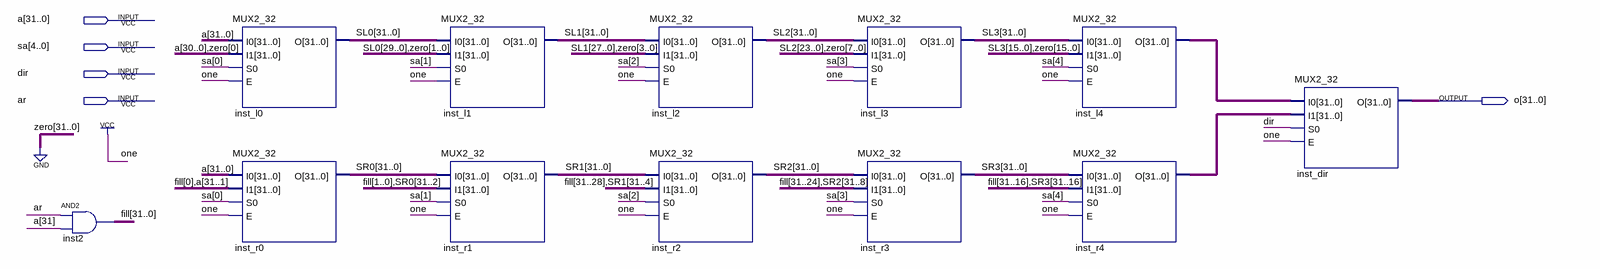
[diagram p0: schematic sheet]
// Quartus schematic SHIFT32.bdf as structural Verilog: 12 symbols, 5 pins
module SHIFT32 (
  input  [31:0] a,
  input  [4:0] sa,
  input  dir,
  input  ar,
  output [31:0] o
);

  wire [31:0] fill, inst_l4_o, inst_r4_o, SL0, SL1, SL2, SL3, SR0, SR1, SR2, SR3;

  assign fill = {32{ar}} & {32{a[31]}};  // AND2 inst2, 32 bits wide
  MUX2_32 inst_l0 (.I0(a), .I1({a[30:0], 1'b0}), .S0(sa[0]), .E(1'b1), .O(SL0));
  MUX2_32 inst_r0 (.I0(a), .I1({fill[0], a[31:1]}), .S0(sa[0]), .E(1'b1), .O(SR0));
  MUX2_32 inst_l1 (.I0(SL0), .I1({SL0[29:0], 2'b00}), .S0(sa[1]), .E(1'b1), .O(SL1));
  MUX2_32 inst_r1 (.I0(SR0), .I1({fill[1:0], SR0[31:2]}), .S0(sa[1]), .E(1'b1), .O(SR1));
  MUX2_32 inst_l2 (.I0(SL1), .I1({SL1[27:0], 4'b0000}), .S0(sa[2]), .E(1'b1), .O(SL2));
  MUX2_32 inst_r2 (.I0(SR1), .I1({fill[31:28], SR1[31:4]}), .S0(sa[2]), .E(1'b1), .O(SR2));
  MUX2_32 inst_l3 (.I0(SL2), .I1({SL2[23:0], {8{1'b0}}}), .S0(sa[3]), .E(1'b1), .O(SL3));
  MUX2_32 inst_r3 (.I0(SR2), .I1({fill[31:24], SR2[31:8]}), .S0(sa[3]), .E(1'b1), .O(SR3));
  MUX2_32 inst_l4 (.I0(SL3), .I1({SL3[15:0], {16{1'b0}}}), .S0(sa[4]), .E(1'b1), .O(inst_l4_o));
  MUX2_32 inst_r4 (.I0(SR3), .I1({fill[31:16], SR3[31:16]}), .S0(sa[4]), .E(1'b1), .O(inst_r4_o));
  MUX2_32 inst_dir (.I0(inst_l4_o), .I1(inst_r4_o), .S0(dir), .E(1'b1), .O(o));
endmodule
